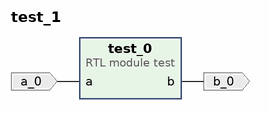
[diagram p0: block diagram of the top level]
# Vivado block design test_1, xc7a35tcpg236-1, Vivado 2019.1
create_bd_design test_1

create_bd_port -dir I a_0
create_bd_port -dir O b_0

create_bd_cell -type module -reference test test_0

# ---- connections ----

connect_bd_net -net a_0_1 [get_bd_ports a_0] [get_bd_pins test_0/a]
connect_bd_net [get_bd_pins test_0/b] [get_bd_ports b_0]

validate_bd_design
save_bd_design
